# EAGLE design MicroMySens-v015 (EAGLE 7.3.0)
MAPLE-CUx Large Version
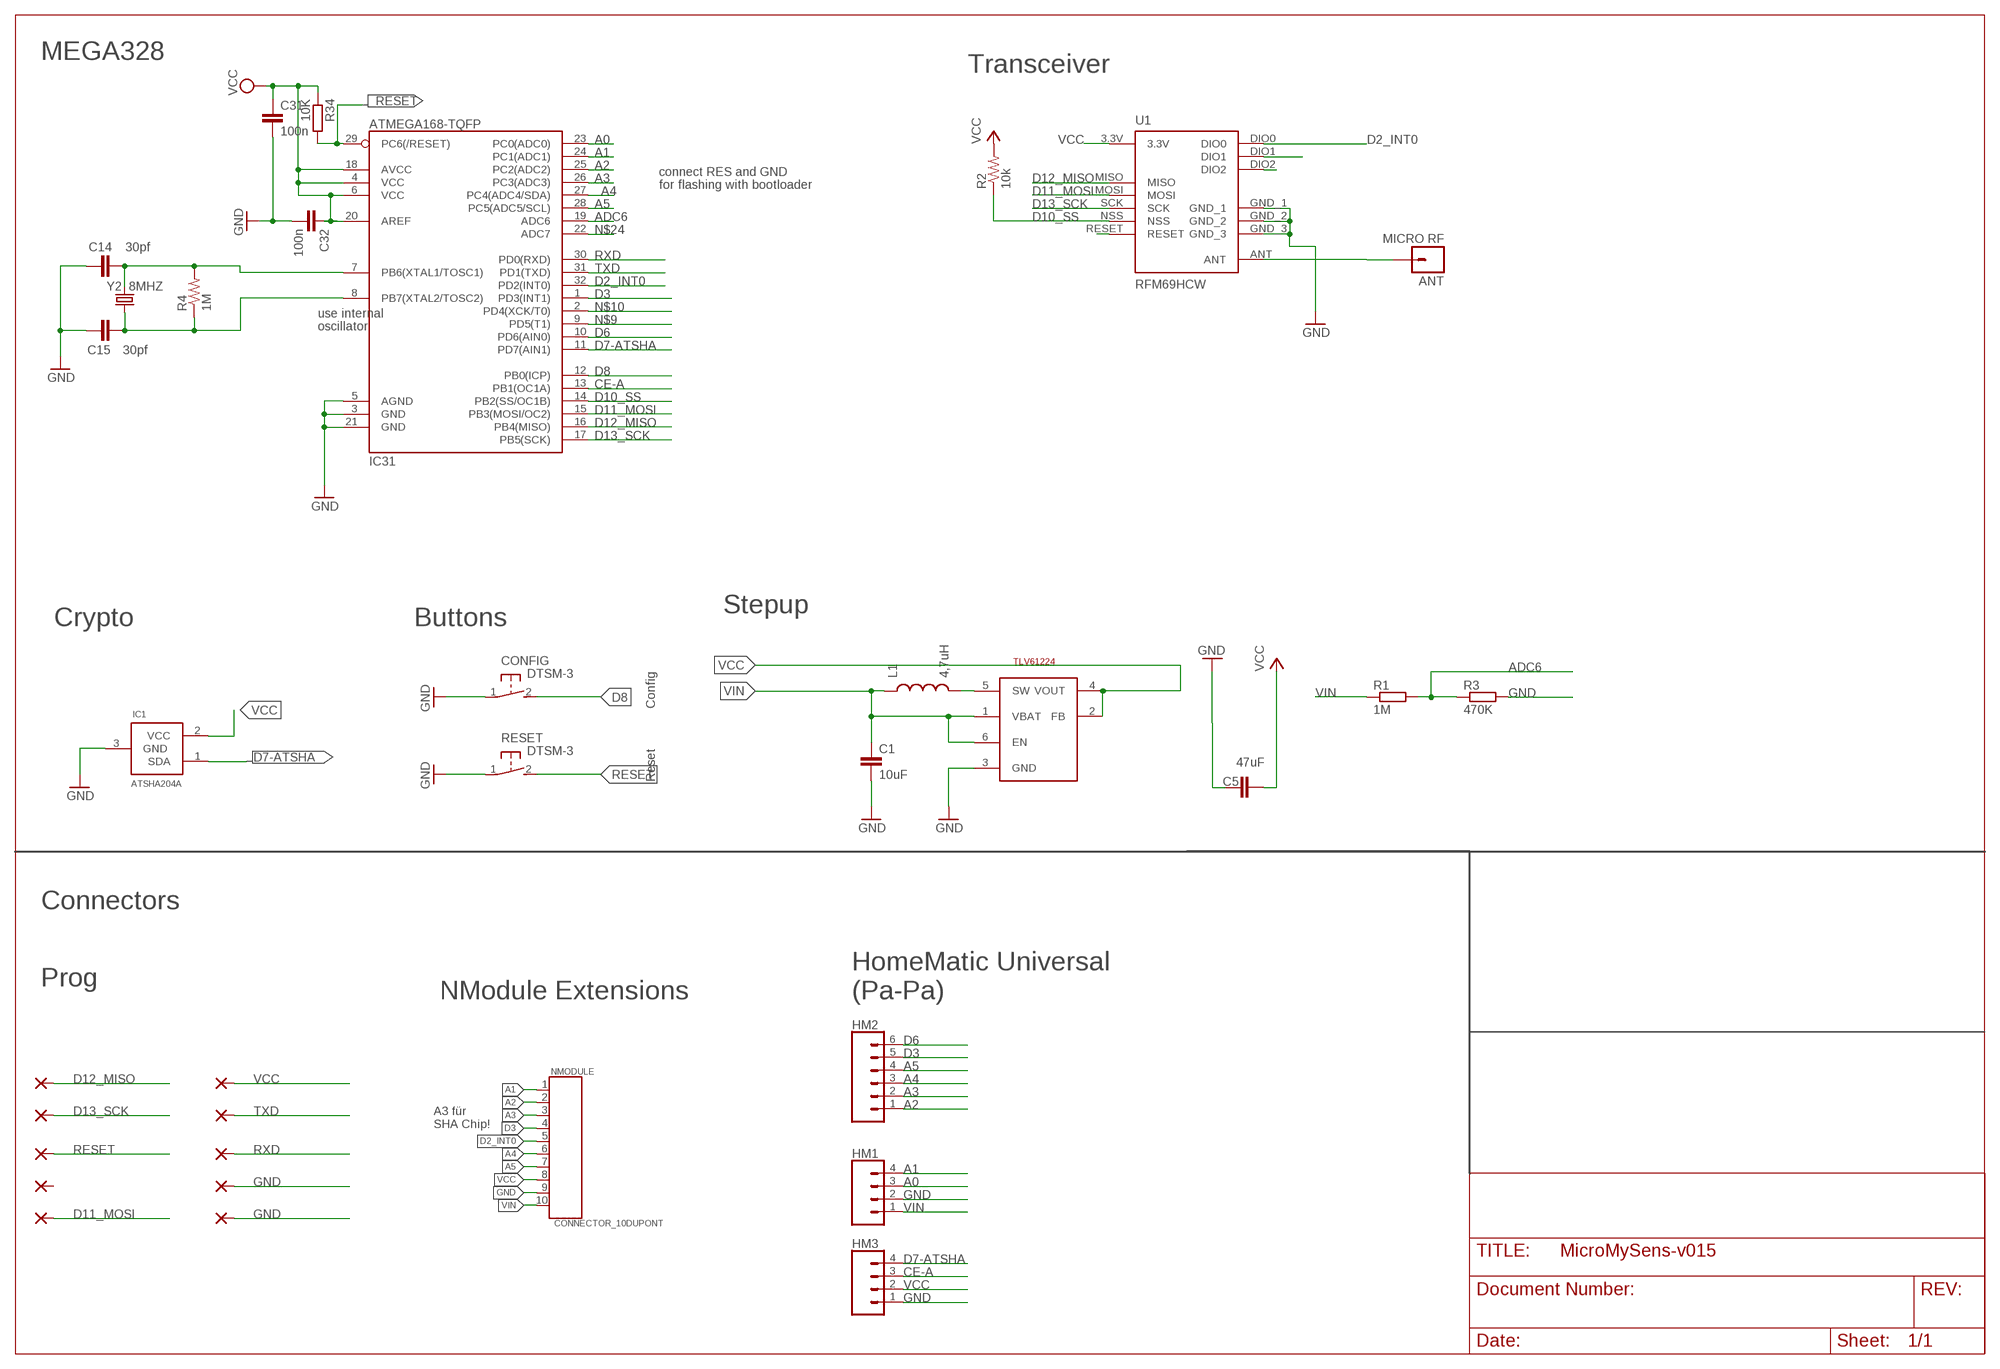
[diagram p0: schematic, sheet 1]

## Parts
ANT  MICRO RF  M01PTH  [1X01]
C1  10uF  CAP0805  [0805]
C5  47uF  C-EUC1210  [C1210]
C14  30pf  CAP0805  [0805]
C15  30pf  CAP0805  [0805]
C31  100n  C-EUC0805  [C0805]
C32  100n  C-EUC0805  [C0805]
CONFIG  DTSM-3  [DTSM-3]
GND  WIREPADSMD1,27-254  [SMD1,27-2,54]
GND2  WIREPADSMD1,27-254  [SMD1,27-2,54]
HM1  CONN_04  [1X04]
HM2  CONN_06SILK_FEMALE_PTH  [1X06]
HM3  CONN_04  [1X04]
IC1  ATSHA204A  [SOT23]
IC31  ATMEGA168-TQFP  [TQFP32-08]
L1  4,7uH  INDUCTOR0805  [0805]
MISO  WIREPADSMD1,27-254  [SMD1,27-2,54]
MOSI  WIREPADSMD1,27-254  [SMD1,27-2,54]
NC  WIREPADSMD1,27-254  [SMD1,27-2,54]
NMODULE  CONNECTOR_10DUPONT  [DUPONT_10]
R1  1M  R-EU_R0805  [R0805]
R2  10k  RESISTOR0805-RES  [0805]
R3  470K  R-EU_R0805  [R0805]
R4  1M  RESISTOR0805-RES  [0805]
R34  10K  R-EU_R0805  [R0805]
RESET  DTSM-3  [DTSM-3]
RST  WIREPADSMD1,27-254  [SMD1,27-2,54]
RXD  WIREPADSMD1,27-254  [SMD1,27-2,54]
SCK  WIREPADSMD1,27-254  [SMD1,27-2,54]
STEPUP  TLV61224  TI-TLV61224  [SOT23-6L]
TXD  WIREPADSMD1,27-254  [SMD1,27-2,54]
U1  RFM69HCW  [RFM69HCW-XXXS2]
VCC  WIREPADSMD1,27-254  [SMD1,27-2,54]
Y2  8MHZ  CRYSTALTXC-7A  [CRYSTAL-TXC-7A]

## Nets
A0: HM1.3 IC31.23(PC0(ADC0))
A1: HM1.4 IC31.24(PC1(ADC1)) NMODULE.1
A2: HM2.1 IC31.25(PC2(ADC2)) NMODULE.2
A3: HM2.2 IC31.26(PC3(ADC3)) NMODULE.3
A4: HM2.3 IC31.27(PC4(ADC4/SDA)) NMODULE.6
A5: HM2.4 IC31.28(PC5(ADC5/SCL)) NMODULE.7
ADC6: IC31.19(ADC6) R1.2 R3.1
ANT: ANT.1 U1.ANT
CE-A: HM3.3 IC31.13(PB1(OC1A))
D2_INT0: IC31.32(PD2(INT0)) NMODULE.5 U1.DIO0
D3: HM2.5 IC31.1(PD3(INT1)) NMODULE.4
D6: HM2.6 IC31.10(PD6(AIN0))
D7-ATSHA: HM3.4 IC1.1(SDA) IC31.11(PD7(AIN1))
D8: CONFIG.2 IC31.12(PB0(ICP))
D10_SS: IC31.14(PB2(SS/OC1B)) R2.1 U1.NSS
D11_MOSI: IC31.15(PB3(MOSI/OC2)) MOSI.1(P) U1.MOSI
D12_MISO: IC31.16(PB4(MISO)) MISO.1(P) U1.MISO
D13_SCK: IC31.17(PB5(SCK)) SCK.1(P) U1.SCK
GND [PWR]: C1.2 C5.1 C14.1 C15.1 C31.2 C32.2 CONFIG.1 GND2.1(P) GND.1(P) HM1.2 HM3.1 IC1.3(GND) IC31.3(GND) IC31.5(AGND) IC31.21(GND) NMODULE.9 R3.2 RESET.1 STEPUP.3(GND) U1.GND_1 U1.GND_2 U1.GND_3
N$3: C14.2 IC31.7(PB6(XTAL1/TOSC1)) R4.2 Y2.P$2
N$9: IC31.9(PD5(T1))
N$10: IC31.2(PD4(XCK/T0))
N$13: L1.2 STEPUP.5(SW)
N$14: U1.DIO2
N$15: U1.DIO1
N$16: U1.RESET
N$19: C15.2 IC31.8(PB7(XTAL2/TOSC2)) R4.1 Y2.P$1
N$24: IC31.22(ADC7)
RESET: IC31.29(PC6(/RESET)) R34.2 RESET.2 RST.1(P)
RXD: IC31.30(PD0(RXD)) RXD.1(P)
TXD: IC31.31(PD1(TXD)) TXD.1(P)
VCC [PWR]: C5.2 C31.1 C32.1 HM3.2 IC1.2(VCC) IC31.4(VCC) IC31.6(VCC) IC31.18(AVCC) IC31.20(AREF) NMODULE.8 R2.2 R34.1 STEPUP.2(FB) STEPUP.4(VOUT) U1.3.3V VCC.1(P)
VIN [PWR]: C1.1 HM1.1 L1.1 NMODULE.10 R1.1 STEPUP.1(VBAT) STEPUP.6(EN)
Unconnected: NC.1(P)

## Notes on the sheet
- MEGA328
- Transceiver
- connect RES and GND
- for flashing with bootloader
- use internal
- oscillator
- Stepup
- Crypto | Buttons
- Config
- Reset
- Connectors
- Prog
- NModule Extensions
- HomeMatic Universal
  (Pa-Pa)
- A3 für 
  SHA Chip!

## Library data of the parts
ANT = SparkFun-Connectors:M01: Header 1 Standard 1-pin 0.1" header. Use with straight break away headers (SKU : PRT-00116), right angle break away headers (PRT-00553), swiss pins (PRT-00743), machine pins (PRT-00117), and female headers (PRT-00115).
C1 = SparkFun-Passives:CAP: Capacitor Standard 0603 ceramic capacitor, and 0.1" leaded capacitor.
C5 C31 C32 = rcl:C-EU: CAPACITOR, European symbol
C14 C15 = doug:CAP: Capacitor Standard 0603 ceramic capacitor, and 0.1" leaded capacitor.
CONFIG RESET = mechanics:DTSM-3: Diptronics SMD button 6x3.5 mm
GND GND2 MISO MOSI NC RST RXD SCK TXD VCC = wirepad:WIREPAD: Wire PAD connect wire on PCB
HM1 HM3 = SparkFun-Connectors:CONN_04: Multi connection point. Often used as Generic Header-pin footprint for 0.1 inch spaced/style header connections On any of the 0.1 inch spaced packages, you can populate with these: Break Away Headers - Straight <https://www.sparkfun.com/products/116> (PRT-00116) Break Away Male Headers - Right Angle <https://www.sparkfun.com/products/553> (PRT-00553) Female Headers <https://www.sparkfun.com/products/115> (PRT-00115) Break Away Headers - Machine Pin <https://www.sparkfun.com/products/117> (PRT-00117) Break Away Female Headers - Swiss Machine Pin <https://www.sparkfun.com/products/743> (PRT-00743) For SCREWTERMINALS and SPRING TERMINALS visit here: Screw Terimnals on SparkFun.com <https://www.sparkfun.com/search/results?term=Screw+Terminals> (5mm/3.5mm/2.54mm spacing) This device is also useful as a general connection point to wire up your design to another part of your project. Our various solder wires solder well into these plated through hole pads. Hook-Up Wire - Assortment (Stranded, 22 AWG) <https://www.sparkfun.com/products/11375> (PRT-11375) Hook-Up Wire - Assortment (Solid Core, 22 AWG) <https://www.sparkfun.com/products/11367> (PRT-11367) View the entire wire category on our website here <https://www.sparkfun.com/categories/141> Special notes: Molex polarized connector foot print use with SKU : PRT-08231 with associated crimp pins and housings. 1MM SMD Version SKU: PRT-10208; PROD_ID: CONN-09696
HM2 = SparkFun-Connectors:CONN_06: Multi connection point. Often used as Generic Header-pin footprint for 0.1 inch spaced/style header connections On any of the 0.1 inch spaced packages, you can populate with these: Break Away Headers - Straight <https://www.sparkfun.com/products/116> (PRT-00116) Break Away Male Headers - Right Angle <https://www.sparkfun.com/products/553> (PRT-00553) Female Headers <https://www.sparkfun.com/products/115> (PRT-00115) Break Away Headers - Machine Pin <https://www.sparkfun.com/products/117> (PRT-00117) Break Away Female Headers - Swiss Machine Pin <https://www.sparkfun.com/products/743> (PRT-00743) Arduino Stackable Header - 6 Pin <https://www.sparkfun.com/products/9280> (PRT-09280) For SCREWTERMINALS and SPRING TERMINALS visit here: Screw Terimnals on SparkFun.com <https://www.sparkfun.com/search/results?term=Screw+Terminals> (5mm/3.5mm/2.54mm spacing) This device is also useful as a general connection point to wire up your design to another part of your project. Our various solder wires solder well into these plated through hole pads. Hook-Up Wire - Assortment (Stranded, 22 AWG) <https://www.sparkfun.com/products/11375> (PRT-11375) Hook-Up Wire - Assortment (Solid Core, 22 AWG) <https://www.sparkfun.com/products/11367> (PRT-11367) View the entire wire category on our website here <https://www.sparkfun.com/categories/141>; PROD_ID: CONN-08437
IC1 = Sensor:ATSHA204A
IC31 = atmel:ATMEGA168: Atmel Atmega 168/328/328P
L1 = SparkFun-Passives:INDUCTOR: Inductors Basic Inductor/Choke - 0603 and 1206. Footprints are not proven and vary greatly between part numbers.
NMODULE = TD-MySensors:CONNECTOR_10
R1 R3 R34 = rcl:R-EU_: RESISTOR, European symbol
R2 R4 = doug:RESISTOR: Resistor Basic schematic elements and footprints for 0603, 1206, and PTH resistors.
STEPUP = TLV61224:TI-TLV61224
U1 = doug:RFM69H
Y2 = SparkFun-FreqCtrl:CRYSTAL: Various standard crystals. Proven footprints.

## Net classes
0 default: width 0.305 mm
1 PWR: width 0.457 mm

## Board
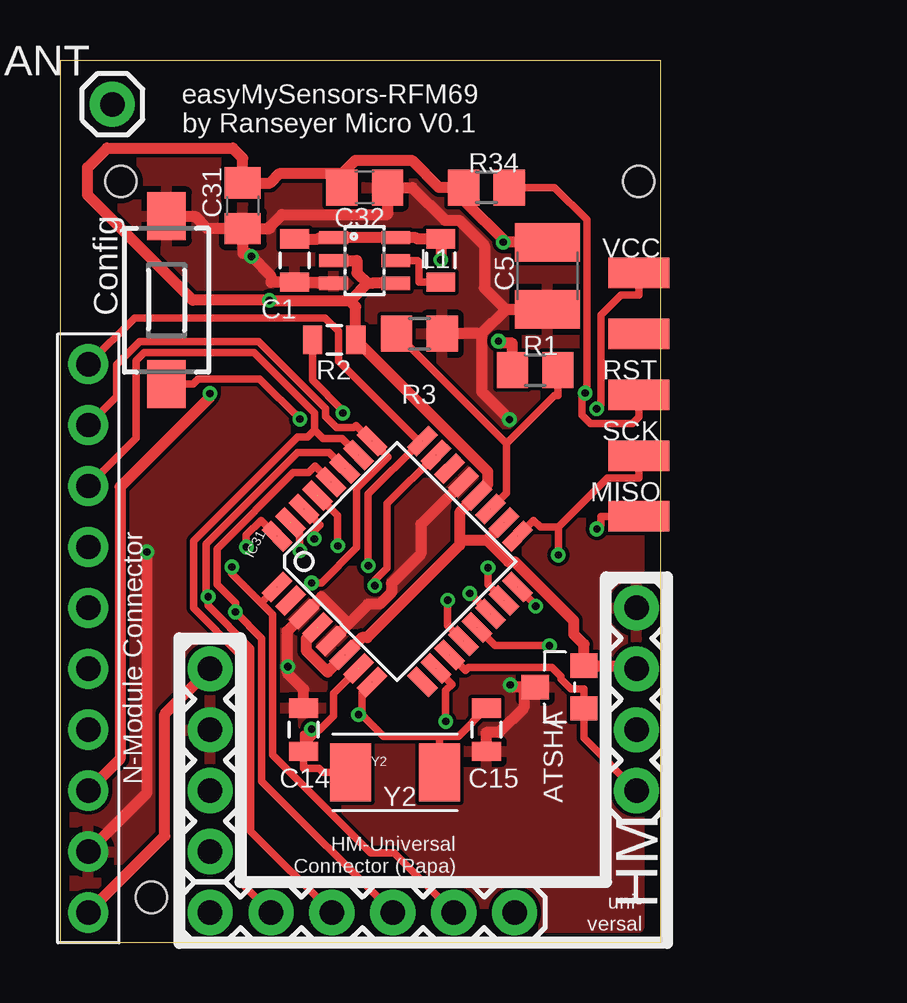
[diagram p1: board, top side]
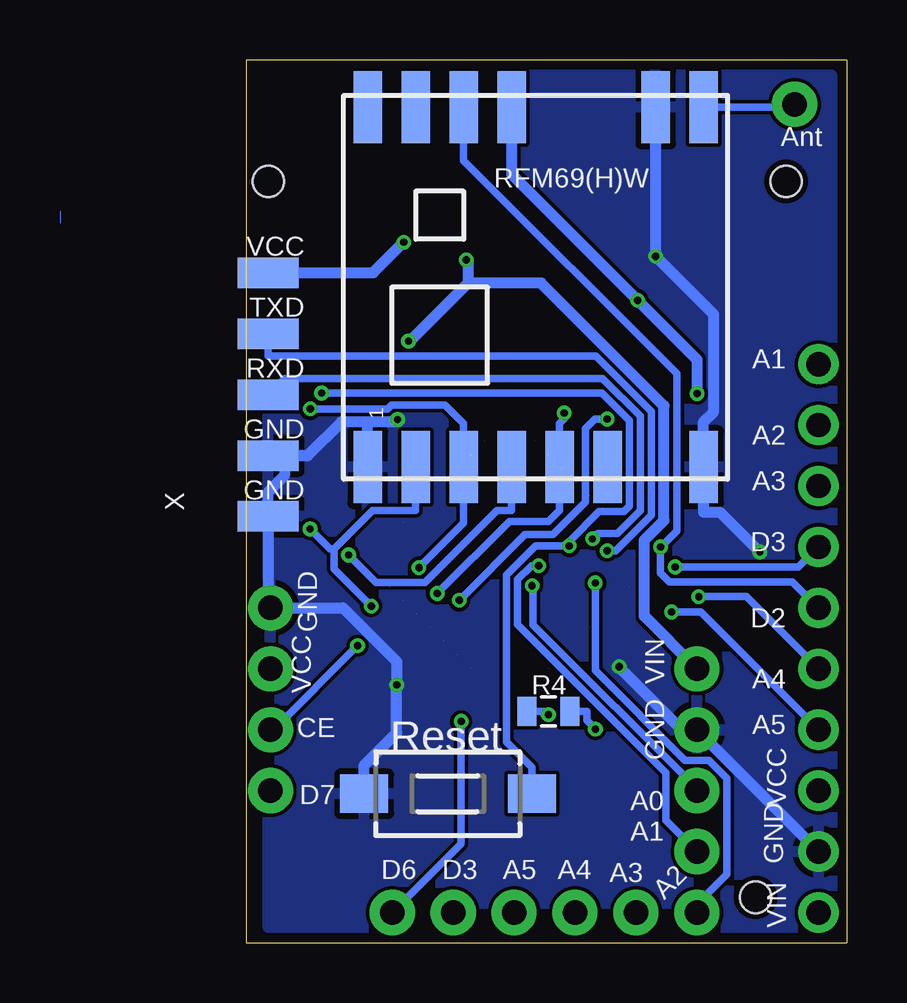
[diagram p2: board, bottom side, seen from below]

Size 25.04 x 36.81 mm. Coordinates in mm from the lower left corner, seen from the top.
Outline: 25.04,36.81 25.04,0 0,0 0,36.81 25.04,36.81
Copper layers (1*16): Top 0.035mm / dielectric 1.5mm / Bottom 0.035mm
Design rules "SeeedStudio_2layer_DRU_no_angle_20140221": minimum track width 6mil, minimum drill 12mil, track to track 6mil, track to pad 6mil, pad to pad 6mil, via to via 6mil, smd to smd 0mil, copper to edge 10mil, drill to drill 10mil, minimum pad ring 10mil, minimum via ring 6mil, stop-mask expansion 2mil, vias tented up to drill 100mil, thermal gap 10mil
Holes 1.3 mm at 24.13,31.75 2.54,31.75 3.81,1.91

### Footprints (pad centres in the part's own frame; a part is rotated, then mirrored left to right if it is on the bottom)
1X01 = drill 1.016 pad 1.88: 1 0,0
0805 = smd 0.8 x 1.2: 1 -0.9,0; 2 0.9,0
C1210 = smd 1.6 x 2.7: 1 -1.4,0; 2 1.4,0
C0805 = smd 1.3 x 1.5: 1 -0.95,0; 2 0.95,0
DTSM-3 = smd 2 x 1.6: 1 -3.494,0; 2 3.494,0
SMD1,27-2,54 = smd 1.27 x 2.54: 1 0,0
1X04 = drill 1.016 pad 1.88: 1 0,0; 2 2.54,0; 3 5.08,0; 4 7.62,0
1X06 = drill 1.016 pad 1.88: 1 0,0; 2 2.54,0; 3 5.08,0; 4 7.62,0; 5 10.16,0; 6 12.7,0
SOT23 = smd 1.016 x 1.143: 1 -0.889,-1.016; 2 0.889,-1.016; 3 0,1.016
TQFP32-08 = smd 1.27 x 0.559: 1 -4.293,2.8; 2 -4.293,2; 3 -4.293,1.2; 4 -4.293,0.4; 5 -4.293,-0.4; 6 -4.293,-1.2; 7 -4.293,-2; 8 -4.293,-2.8; 17 4.293,-2.8; 18 4.293,-2; 19 4.293,-1.2; 20 4.293,-0.4; 21 4.293,0.4; 22 4.293,1.2; 23 4.293,2; 24 4.293,2.8 | smd 0.559 x 1.27: 9 -2.8,-4.293; 10 -2,-4.293; 11 -1.2,-4.293; 12 -0.4,-4.293; 13 0.4,-4.293; 14 1.2,-4.293; 15 2,-4.293; 16 2.8,-4.293; 25 2.8,4.293; 26 2,4.293; 27 1.2,4.293; 28 0.4,4.293; 29 -0.4,4.293; 30 -1.2,4.293; 31 -2,4.293; 32 -2.8,4.293
DUPONT_10 = drill 1.016 pad 1.676: 1 1.27,1.27; 2 3.81,1.27; 3 6.35,1.27; 4 8.89,1.27; 5 11.43,1.27; 6 13.97,1.27; 7 16.51,1.27; 8 19.05,1.27; 9 21.59,1.27; 10 24.13,1.27
R0805 = smd 1.3 x 1.5: 1 -0.95,0; 2 0.95,0
SOT23-6L = smd 0.55 x 1.2: 1 -0.95,-1.3; 2 0,-1.3; 3 0.95,-1.3; 4 0.95,1.3; 5 0,1.3; 6 -0.95,1.3
RFM69HCW-XXXS2 = smd 3 x 1.2: 3.3V 7.5,1; ANT 7.5,-7; DIO0 7.5,3; DIO1 7.5,5; DIO2 7.5,7; GND_1 7.5,-5; GND_2 -7.5,-7; GND_3 -7.5,7; MISO -7.5,5; MOSI -7.5,3; NSS -7.5,-1; RESET -7.5,-3; SCK -7.5,1
CRYSTAL-TXC-7A = smd 1.7 x 2.4: P$1 1.85,0; P$2 -1.85,0

### Placement (x,y rotation side)
ANT  2.19,34.96 0 top
C1  9.78,28.45 270 top
C5  20.32,27.81 90 top
C14  10.16,8.89 270 top
C15  17.78,8.89 90 top
C31  7.62,30.73 270 top
C32  12.7,31.5 0 top
CONFIG  4.45,26.8 270 top
GND  24.13,17.78 90 bottom
GND2  24.13,20.32 90 bottom
HM1  6.25,11.43 270 top
HM2  6.25,1.27 0 top
HM3  24.04,13.97 270 top
IC1  20.83,10.67 90 top
IC31  14.06,15.9 45 top
L1  15.88,28.45 270 top
MISO  24.13,17.78 90 top
MOSI  24.13,27.94 90 top
NC  24.13,25.4 90 top
NMODULE  -0.09,25.4 270 top
R1  19.81,23.88 0 top
R2  11.43,25.15 0 top
R3  14.99,25.4 0 top
R4  12.45,9.65 0 bottom
R34  17.78,31.5 0 top
RESET  16.64,6.22 0 bottom
RST  24.13,22.86 90 top
RXD  24.13,22.86 90 bottom
SCK  24.13,20.32 90 top
STEPUP  12.7,28.45 270 top
TXD  24.13,25.4 90 bottom
U1  12.98,27.34 90 bottom
VCC  24.13,27.94 90 bottom
Y2  13.97,7.11 0 top

### Tracks (layer width: path | path; a pad name or v marks a point on that pad's centre or on a via)
A0  (via drill 0.3 pad 0.61)  (1 unrouted)
  Top 0.305: IC31.23 13.64,18.31 13.64,15.64 13.13,15.12 v13.13,14.89
  Bottom 0.305: HM1.3 6.25,6.44 13.08,13.27 13.08,14.85 | 13.08,14.85 | 13.08,14.85 v13.13,14.89
A1  (via drill 0.3 pad 0.61)  (1 unrouted)
  Top 0.305: 14.94,20.92 14.94,20.81 12.85,18.72 v12.85,15.72 | 14.94,20.92 IC31.24 | 14.94,20.92 11.61,24.25 11.61,25.5 11.06,26.05 3.1,26.05 NMODULE.1
  Bottom 0.305: HM1.4 7.55,5.11 7.55,7.09 13.74,13.28 13.74,15.15 13.16,15.72 v12.85,15.72 | v12.85,15.72
A2  (via drill 0.3 pad 0.61)  (1 unrouted)
  Top 0.305: NMODULE.2 2.37,22.77 2.37,24.11 3.32,25.07 8.28,25.07 11.07,22.28 11.07,21.95 11.53,21.48 12.24,21.48 12.34,21.58 IC31.25 13.67,20.25 | 13.67,20.25 | 13.67,20.25 12.37,18.95 12.37,16.48 10.9,15.01 v10.49,15.01
  Bottom 0.305: HM2.1 6.25,1.62 5.01,2.87 5.01,6.86 5.76,7.62 6.75,7.62 10.49,11.36 v10.49,15.01
A3  (1 unrouted)
  Top 0.305: 10.61,21.38 10.61,22.09 8.09,24.61 3.52,24.61 3.19,24.28 3.19,21.05 NMODULE.3 | HM2.2 7.5,2.56 7.5,12.03 5.57,13.96 5.57,16.76 9.9,21.1 10.33,21.1 10.61,21.38 | IC31.26 11.77,21.02 10.97,21.02 10.61,21.38
A4  (via drill 0.3 pad 0.61)  (1 unrouted)
  Top 0.305: v6.18,14.44 6.09,14.53 6.09,16.63 9.91,20.45 11.21,20.45 IC31.27 | v6.18,14.44 | v6.18,14.44 6.18,14.07 7.96,12.29 7.96,4.65 HM2.3
  Bottom 0.305: NMODULE.6 4.19,14.44 v6.18,14.44
A5  (via drill 0.3 pad 0.61)  (1 unrouted)
  Top 0.305: HM2.4 8.41,6.73 8.41,12.7 v7.32,13.8 7.32,14.17 6.55,14.94 6.55,16.43 9.72,19.61 10.37,19.61 10.64,19.88 IC31.28
  Bottom 0.305: NMODULE.7 6.09,13.8 v7.32,13.8
ADC6  (1 unrouted)
  Top 0.305: R1.2 20.76,22.82 20.61,22.82 18.61,20.83 | 18.61,20.83 18.61,18.75 IC31.19 | R3.1 18.61,20.83
ANT
  Bottom 0.305: U1.ANT 2.31,34.84 ANT.1
CE-A  (via drill 0.3 pad 0.61)  (1 unrouted)
  Top 0.305: IC31.13 18.14,12.39 v20.41,12.39
  Bottom 0.305: v20.41,12.39 23.91,8.89 HM3.3
D2_INT0  (via drill 0.3 pad 0.61)  (1 unrouted)
  Top 0.305: v7.76,16.51 7.76,17 8.38,17.62 IC31.32
  Bottom 0.305: U1.DIO0 15.98,32.62 7.09,23.73 7.09,17.18 v7.76,16.51 7.78,16.49 7.78,15.42 7.41,15.06 2.27,15.06 NMODULE.5
D3  (via drill 0.3 pad 0.61)  (1 unrouted)
  Top 0.305: 8.38,14.18 7.16,15.4 v7.16,15.67 | 8.38,14.18 8.87,13.69 8.87,7.84 12.95,3.76 13.92,3.76 HM2.5 | IC31.1 8.38,14.18
  Bottom 0.305: NMODULE.4 2.02,15.67 v7.16,15.67
D6  (via drill 0.3 pad 0.61)  (1 unrouted)
  Top 0.305: IC31.10 16.35,10.79 16.08,10.52 v16.08,9.24
  Bottom 0.305: v16.08,9.24 16.08,4.14 HM2.6
D7-ATSHA  (1 unrouted)
  Top 0.305: IC31.11 16.91,11.35 17.04,11.48 20.51,11.48 20.88,11.12 20.88,11.01 21.3,10.59 21.84,10.59 IC1.1 21.84,8.54 HM3.4
D8  (via drill 0.3 pad 0.61)  (1 unrouted)
  Top 0.305: v10,21.84 8.32,23.52 5.76,23.52 5.55,23.3 CONFIG.2 | v16.16,14.29 16.16,13.26 16.15,13.25 IC31.12
  Bottom 0.305: v10,21.84 10.51,21.84 10.91,21.44 10.91,18.38 12.27,17.02 13.43,17.02 v16.16,14.29
D10_SS  (via drill 0.3 pad 0.61)  (1 unrouted)
  Top 0.305: v17.08,14.57 v17.09,14.57 IC31.14 | v11.79,22.09 11.79,22.21 10.53,23.46 R2.1
  Bottom 0.305: v17.08,14.57 14.07,17.58 12.44,17.58 11.98,18.04 U1.NSS 11.98,20.74 11.98,21.64 11.79,21.84 v11.79,22.09
D11_MOSI  (via drill 0.3 pad 0.61)  (1 unrouted)
  Top 0.305: v17.84,15.64 v17.85,15.64 17.85,14.94 IC31.15 | v22.38,22.26 22.55,22.44 22.55,26.16 23.39,27 24.13,27 MOSI.1
  Bottom 0.305: v17.84,15.64 15.98,17.51 U1.MOSI 15.98,21.64 16.77,22.43 18.99,22.43 19.16,22.26 v22.38,22.26
D12_MISO  (via drill 0.3 pad 0.61)  (1 unrouted)
  Top 0.305: MISO.1 22.55,17.78 22.55,17.43 v22.38,17.26 | v19.84,14.04 19.74,14.14 19.74,14.18 IC31.16
  Bottom 0.305: 21.39,16.43 21.55,16.43 v22.38,17.26 | 21.39,16.43 21.39,15.59 v19.84,14.04 | 21.39,16.43 19.78,18.04 17.98,18.04 U1.MISO
D13_SCK  (via drill 0.3 pad 0.61)  (1 unrouted)
  Top 0.305: IC31.17 19.74,17.62 20.03,17.33 20.78,17.33 | SCK.1 24.13,19.38 22.82,19.38 20.78,17.33 | v20.78,16.18 20.78,17.33
  Bottom 0.305: v20.78,16.18 19.64,15.04 17.59,15.04 14.59,18.04 13.98,18.04 U1.SCK
GND  (via drill 0.3 pad 0.61)
  Top 0.457: 18.59,26.41 17.69,27.31 17.69,29.08 16.64,30.13 16.05,30.13 14.68,31.5 C32.2 13.65,30.36 9.25,30.36 8.75,29.87 8.75,29.78 C31.2 | C31.2 7.62,28.75 7.85,28.75 v7.98,28.62 8.8,27.81 8.8,27.55 C1.2 10.76,27.55 10.81,27.5 STEPUP.3 | C31.2 6.13,29.78 5.63,30.29 CONFIG.1 | 18.59,26.41 17.58,25.4 | C15.1 17.78,8.77 18.3,8.77 19.34,9.8 19.34,10.67 | 19.34,10.67 18.86,10.67 v18.77,10.76 | IC1.3 19.34,10.67 | 17.58,25.4 R3.2 | 17.58,25.4 17.58,22.98 v18.74,21.82 | 12.03,13.3 10.9,14.43 IC31.3 9.46,13 9.5,12.96 v9.5,11.51 9.5,11.23 10.16,10.57 C14.1 | IC31.21 15.04,17.45 15.04,16.22 13.81,14.99 13.81,14.61 13.32,14.12 12.84,14.12 12.03,13.3 | IC31.5 12.03,13.3 | C5.1 18.59,26.41 | NMODULE.9 3.63,6.26 v3.63,16.3
  Bottom 0.457: NMODULE.9 HM1.2 6.87,8.89 v9.5,11.51 | 23.45,20.32 23.45,19.48 24.13,18.8 GND.1 24.13,14.06 HM3.1 21.01,13.97 18.77,11.73 v18.77,10.76 18.77,8.76 20.13,7.4 RESET.1 | 23.45,20.32 22.48,20.32 21.08,21.72 19.98,21.72 | GND2.1 23.45,20.32 | v18.74,21.82 18.84,21.72 19.98,21.72 | U1.GND_3 19.98,21.72 | v3.63,16.3 5.29,17.96 5.98,17.96 U1.GND_2 5.98,21.72 5.56,22.14 5.56,26.2 v7.98,28.62 U1.GND_1
  pour Bottom: 24.13,0.64 24.13,36.2 0.64,36.2 0.64,0.64
  pour Top: 0.64,0.64 0.64,36.2 24.13,36.2 24.13,0.64
N$3  (via drill 0.3 pad 0.61)  (1 unrouted)
  Top 0.305: 10.16,8.23 11.4,9.47 11.4,10.41 IC31.7 | 10.16,8.23 10.16,8.7 10.27,8.7 v10.49,8.92 | 10.16,8.23 C14.2 10.16,7.29 10.79,7.29 10.96,7.11 Y2.P$2
  Bottom 0.305: R4.2 10.84,9.65 10.84,9.27 v10.49,8.92
N$5
  Bottom 0: 32.81,30.5 32.81,30
N$13
  Top 0.305: L1.2 14.97,27.55 14.97,28.38 14.9,28.45 STEPUP.5
N$19  (via drill 0.3 pad 0.61)  (1 unrouted)
  Top 0.305: 12.6,9.51 v12.45,9.51 | 12.6,9.51 12.6,10.47 IC31.8 | 15.82,8.62 13.49,8.62 12.6,9.51 | Y2.P$1 15.82,8.62 | 15.82,8.62 16.61,8.62 C15.2
  Bottom 0.305: v12.45,9.51 12.59,9.65 12.64,9.65 R4.1
RESET  (via drill 0.3 pad 0.61)  (1 unrouted)
  Top 0.305: R34.2 20.62,31.5 21.98,30.14 21.98,23 v21.9,22.93 21.77,22.79 21.77,22.01 22.12,21.65 23.86,21.65 24.13,21.92 RST.1 | IC31.29 11.58,17.82 v11.58,16.55
  Bottom 0.305: v21.9,22.93 10.22,22.93 9.07,21.78 9.07,18.21 9.31,17.98 10.34,17.98 11.58,16.75 v11.58,16.55 12.98,16.55 14.2,15.34 14.2,8.38 13.14,7.33 RESET.2
RXD  (via drill 0.3 pad 0.61)  (1 unrouted)
  Top 0.305: IC31.30 10.84,17.42 10.61,17.19 v10.61,16.84
  Bottom 0.305: v10.61,16.84 10.39,17.07 9.57,17.07 8.62,18.02 8.62,21.97 10.19,23.54 23.45,23.54 RXD.1
TXD  (via drill 0.3 pad 0.61)  (1 unrouted)
  Top 0.305: IC31.31 10,17.14 v10,16.35
  Bottom 0.305: v10,16.35 9.64,16.35 8.16,17.84 8.16,22.16 10.47,24.46 24.13,24.46 TXD.1
VCC  (via drill 0.3 pad 0.61)  (3 unrouted)
  Top 0.457: 12.09,26.77 12.33,26.52 R2.2 17.84,19.63 17.84,19.12 IC31.20 16.66,17.93 | 12.09,26.77 8.76,26.77 v8.73,26.79 5.54,26.79 1.15,31.18 1.15,32.33 1.96,33.14 7.2,33.14 7.62,32.72 C31.1 8.75,31.68 9.13,32.06 11.75,32.06 | 12.82,27.5 12.09,26.77 | 12.82,27.5 | 12.82,27.5 13.02,27.5 | 13.02,27.5 | 12.82,27.5 12.38,27.93 12.38,28.45 STEPUP.2 | STEPUP.4 13.02,27.5 | v18.48,29.21 18.59,29.21 | 18.59,29.21 16.83,30.97 R34.1 15.8,31.5 14.67,32.63 12.32,32.63 11.75,32.06 | C5.2 18.59,29.21 | 17.79,16.8 18.7,15.9 18.96,15.9 21.41,13.45 21.41,12.88 21.84,12.45 IC1.2 23.91,11.56 HM3.2 | 16.66,16.8 17.79,16.8 | 17.79,16.8 | 16.66,16.8 16.66,16.59 12.81,12.74 12.59,12.74 | 12.59,12.74 | 16.66,17.93 | 16.66,17.93 16.66,16.8 | IC31.18 17.79,16.8 | 12.59,12.74 IC31.6 11.16,11.3 10.28,12.18 10.28,12.68 IC31.4 | C32.1 11.75,32.06 | v6.25,22.9 6.25,22.77 2.5,19.02 2.5,7.67 NMODULE.8
  Bottom 0.457: VCC.1 19.75,27.94 v18.48,29.21 | U1.3.3V 13.98,32.04 v8.73,26.79 6.25,24.31 v6.25,22.9
VIN  (via drill 0.3 pad 0.61)
  Top 0.457: C1.1 10.76,29.35 10.81,29.4 STEPUP.1 STEPUP.6 14.84,29.4 14.89,29.35 L1.1 15.88,28.57 v15.88,28.48 | v18.28,25.09 18.36,25.01 18.86,25.01 R1.1 | NMODULE.10 4.37,4.46 4.37,9.55 HM1.1
  Bottom 0.457: HM1.1 8.45,13.63 8.45,16.79 7.63,17.61 7.63,22.39 12.75,27.51 15.8,27.51 | 15.8,27.51 18.22,25.09 v18.28,25.09 | v15.88,28.48 15.8,28.41 15.8,27.51

### Text on the board
tPlace: HM | uni- / versal
tNames: easyMySensors-RFM69 / by Ranseyer Micro V0.1 | R34 | C31 | C32 | VCC | C5 | Config | C1 | R1 | R2 | RST | R3 | SCK | MISO | N-Module Connector | C14 | Y2 | C15 | ATSHA | HM-Universal / Connector (Papa)
bNames: Ant | RFM69(H)W | VCC | TXD | A1 | RXD | A2 | GND | A3 | GND | X | D3 | D2 | GND | A4 | VIN | R4 | A5 | VCC | CE | GND | Reset | D7 | VCC | A0 | A1 | GND | A3 | A4 | A5 | D3 | D6 | A2 | VIN